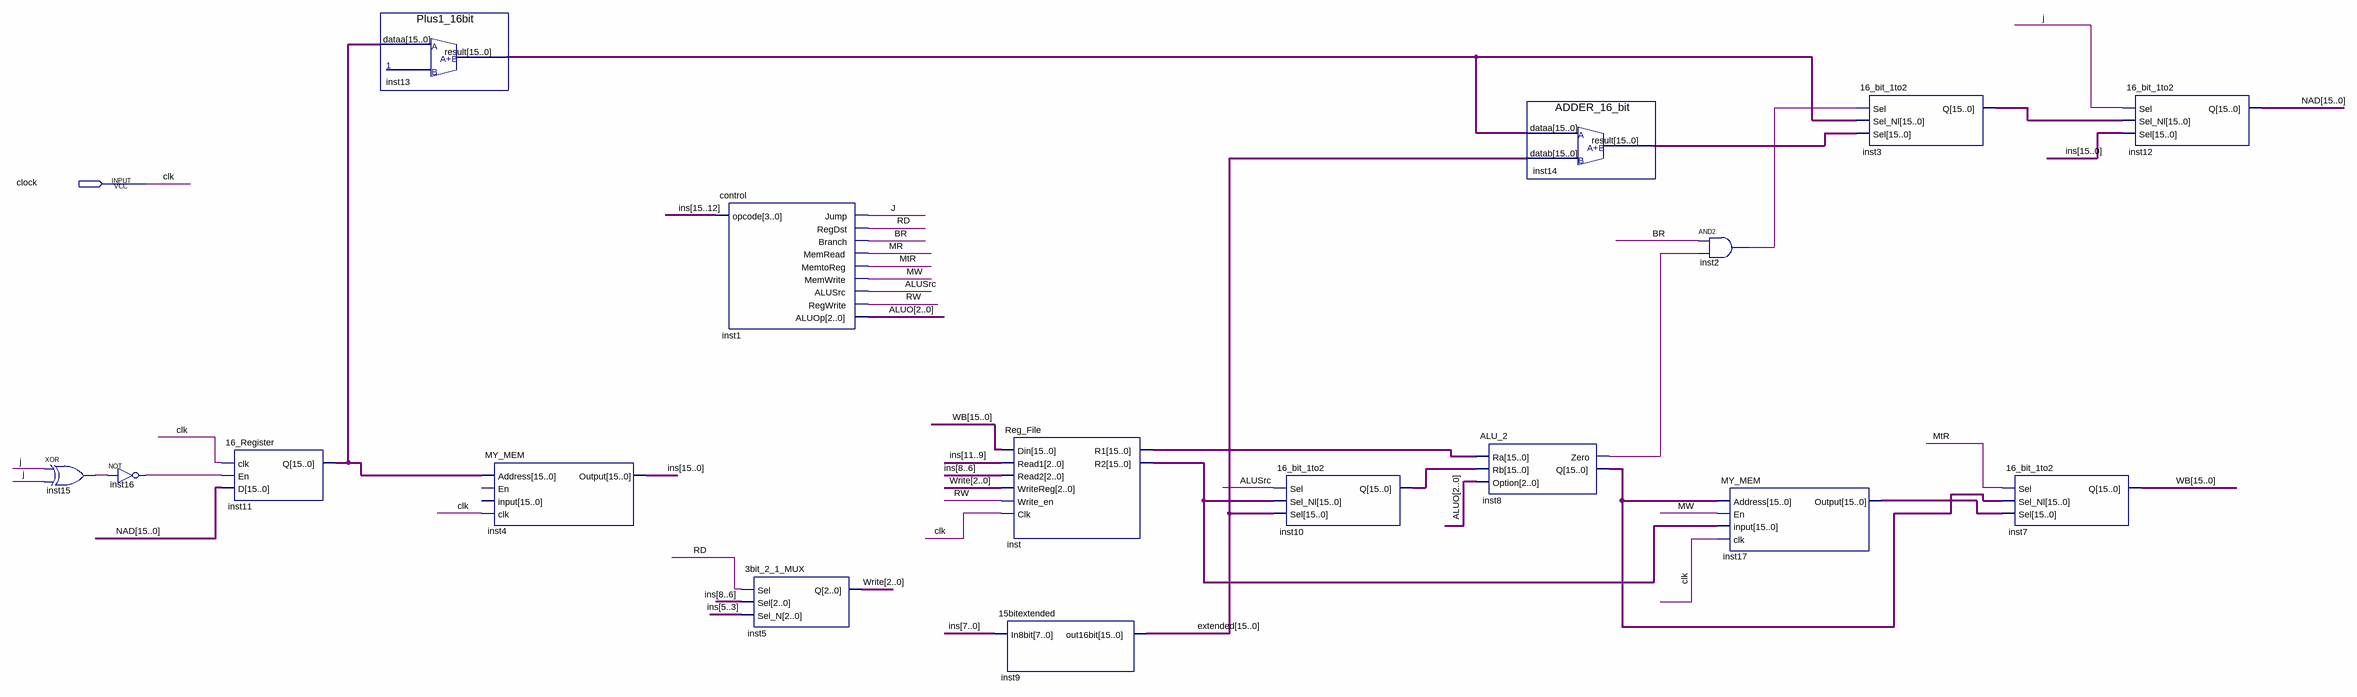
[diagram p0: schematic sheet]
// Quartus schematic CPU1.bdf as structural Verilog: 17 symbols, 1 pins
module CPU1 (
  input  clock
);

  wire ALUSrc, BR, inst2_out, inst8_zero, inst15_out, inst16_out, J, MR, MtR, MW, RD, RW;
  wire [2:0] ALUO, Write;
  wire [15:0] extended, ins, inst3_q, inst8_q, inst10_q, inst11_q, inst13_result, inst14_result,
       inst17_output, inst_r1, inst_r2, NAD, WB;

  xor inst15 (inst15_out, J, J);
  not inst16 (inst16_out, inst15_out);
  \16_Register  inst11 (.clk(clock), .En(inst16_out), .D(NAD), .Q(inst11_q));
  Plus1_16bit inst13 (.dataa(inst11_q), .result(inst13_result));
  MY_MEM inst4 (.Address(inst11_q), .clk(clock), .Output(ins));  // open: En, input
  control inst1 (
    .opcode(ins[15:12]), .Jump(J), .RegDst(RD), .Branch(BR), .MemRead(MR), .MemtoReg(MtR), .MemWrite(MW),
    .ALUSrc(ALUSrc), .RegWrite(RW), .ALUOp(ALUO));
  \3bit_2_1_MUX  inst5 (.Sel({ins[8:7], RD, ins[6]}), .Sel_N(ins[5:3]), .Q(Write));
  Reg_File inst (
    .Read1(ins[11:9]), .Din(WB), .WriteReg(Write), .Read2(ins[8:6]), .Write_en(RW), .Clk(clock),
    .R1(inst_r1), .R2(inst_r2));
  \15bitextended  inst9 (.In8bit(ins[7:0]), .out16bit(extended));
  \16_bit_1to2  inst10 (.Sel({extended[15:1], ALUSrc, extended[0]}), .Sel_Nl(inst_r2), .Q(inst10_q));
  ALU_2 inst8 (.Ra(inst_r1), .Rb(inst10_q), .Option(ALUO), .Zero(inst8_zero), .Q(inst8_q));
  ADDER_16_bit inst14 (.dataa(inst13_result), .datab(extended), .result(inst14_result));
  and inst2 (inst2_out, BR, inst8_zero);
  MY_MEM inst17 (.Address(inst8_q), .En(MW), .\input (inst_r2), .clk(clock), .Output(inst17_output));
  \16_bit_1to2  inst3 (.Sel({inst14_result[15:1], inst2_out, inst14_result[0]}), .Sel_Nl(inst13_result), .Q(inst3_q));
  \16_bit_1to2  inst7 (.Sel({inst17_output[15:1], MtR, inst17_output[0]}), .Sel_Nl(inst8_q), .Q(WB));
  \16_bit_1to2  inst12 (.Sel({ins[15:1], J, ins[0]}), .Sel_Nl(inst3_q), .Q(NAD));

  // Other names for the same wires on the sheet: clk = clock
endmodule
